# EAGLE schematic Wiring Diagram (EAGLE 7.7.0)
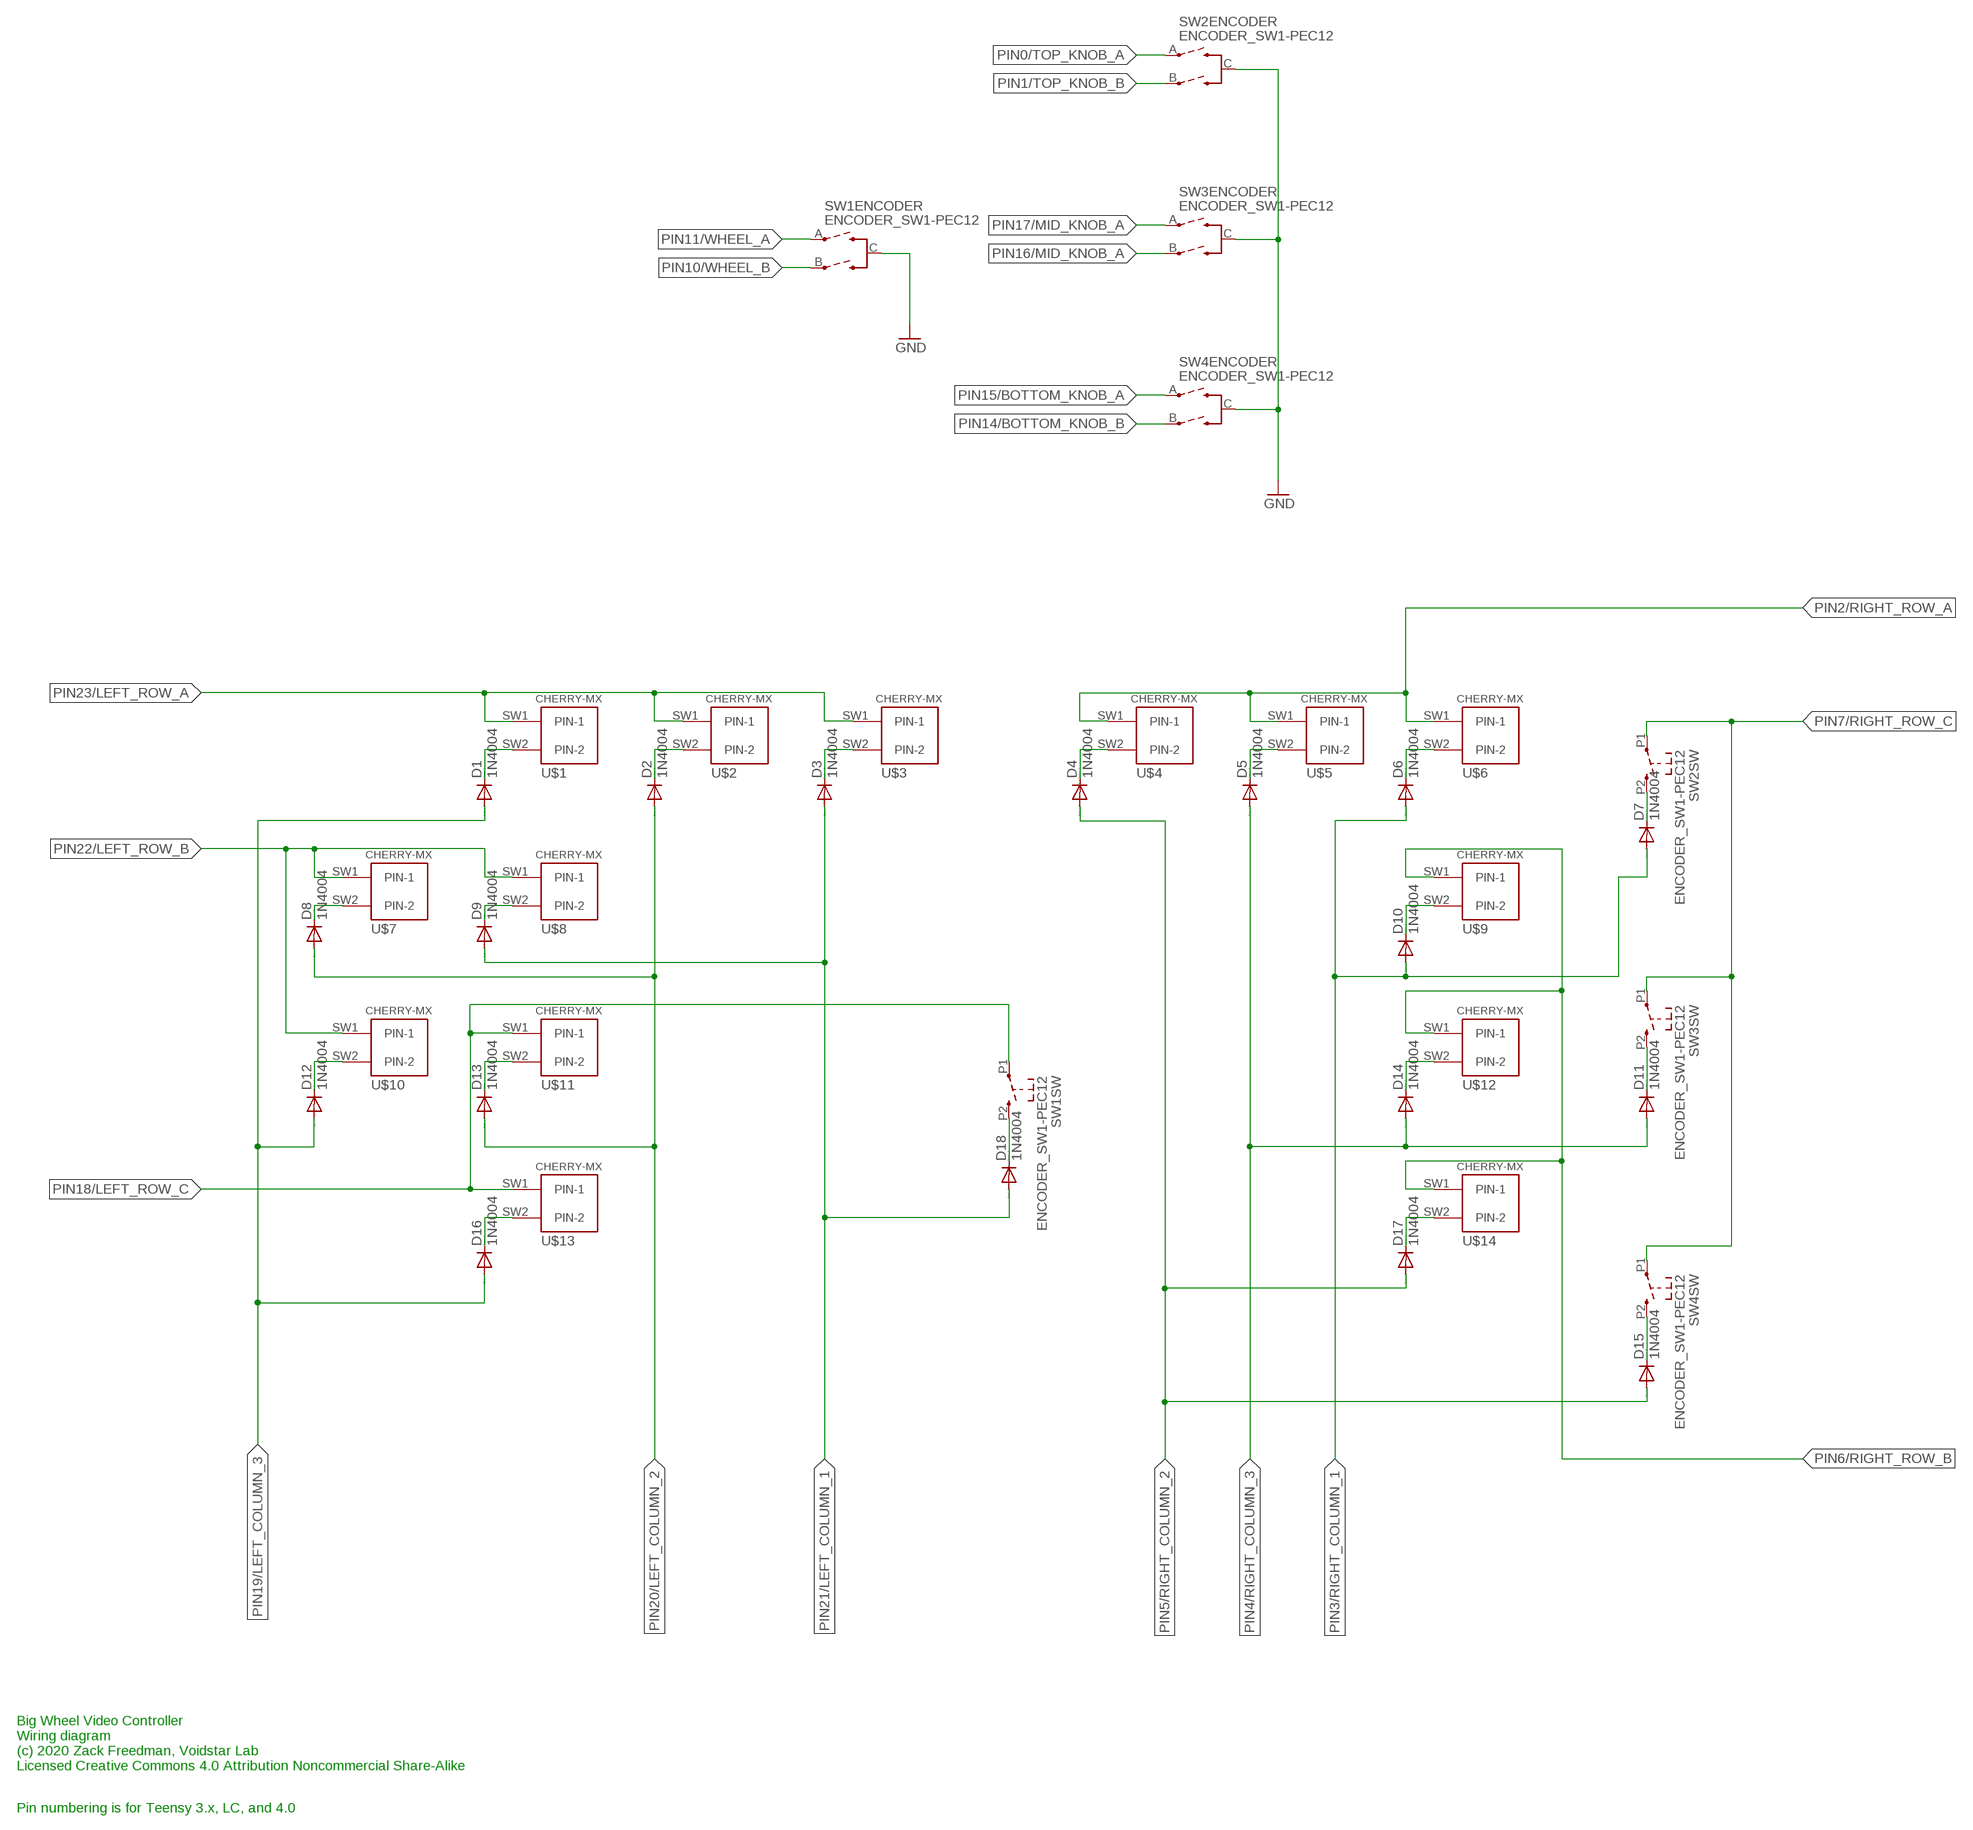
[diagram p0: schematic, sheet 1]

## Parts
D1  1N4004  [DO41-10]
D2  1N4004  [DO41-10]
D3  1N4004  [DO41-10]
D4  1N4004  [DO41-10]
D5  1N4004  [DO41-10]
D6  1N4004  [DO41-10]
D7  1N4004  [DO41-10]
D8  1N4004  [DO41-10]
D9  1N4004  [DO41-10]
D10  1N4004  [DO41-10]
D11  1N4004  [DO41-10]
D12  1N4004  [DO41-10]
D13  1N4004  [DO41-10]
D14  1N4004  [DO41-10]
D15  1N4004  [DO41-10]
D16  1N4004  [DO41-10]
D17  1N4004  [DO41-10]
D18  1N4004  [DO41-10]
SW1  ENCODER_SW1-PEC12  [PEC12_INCREMENTAL_ENCODER]
SW2  ENCODER_SW1-PEC12  [PEC12_INCREMENTAL_ENCODER]
SW3  ENCODER_SW1-PEC12  [PEC12_INCREMENTAL_ENCODER]
SW4  ENCODER_SW1-PEC12  [PEC12_INCREMENTAL_ENCODER]
U$1  CHERRY-MX  [CHERRY-MX]
U$2  CHERRY-MX  [CHERRY-MX]
U$3  CHERRY-MX  [CHERRY-MX]
U$4  CHERRY-MX  [CHERRY-MX]
U$5  CHERRY-MX  [CHERRY-MX]
U$6  CHERRY-MX  [CHERRY-MX]
U$7  CHERRY-MX  [CHERRY-MX]
U$8  CHERRY-MX  [CHERRY-MX]
U$9  CHERRY-MX  [CHERRY-MX]
U$10  CHERRY-MX  [CHERRY-MX]
U$11  CHERRY-MX  [CHERRY-MX]
U$12  CHERRY-MX  [CHERRY-MX]
U$13  CHERRY-MX  [CHERRY-MX]
U$14  CHERRY-MX  [CHERRY-MX]

## Nets
GND: SW1.C(ENCODER:C) SW2.C(ENCODER:C) SW3.C(ENCODER:C) SW4.C(ENCODER:C)
N$1: D1.C U$1.SW2(PIN-2)
N$2: D2.C U$2.SW2(PIN-2)
N$3: D3.C U$3.SW2(PIN-2)
N$6: D10.C U$9.SW2(PIN-2)
N$10: D9.C U$8.SW2(PIN-2)
N$12: D18.C SW1.P2
N$15: D12.C U$10.SW2(PIN-2)
N$16: D16.C U$13.SW2(PIN-2)
N$17: D8.C U$7.SW2(PIN-2)
N$18: D13.C U$11.SW2(PIN-2)
N$20: D6.C U$6.SW2(PIN-2)
N$21: D7.C SW2.P2
N$26: D11.C SW3.P2
N$27: D15.C SW4.P2
N$28: D17.C U$14.SW2(PIN-2)
N$29: D14.C U$12.SW2(PIN-2)
N$30: D5.C U$5.SW2(PIN-2)
N$31: D4.C U$4.SW2(PIN-2)
PIN0/TOP_KNOB_A: SW2.A(ENCODER:A)
PIN1/TOP_KNOB_B: SW2.B(ENCODER:B)
PIN2/RIGHT_ROW_A: U$4.SW1(PIN-1) U$5.SW1(PIN-1) U$6.SW1(PIN-1)
PIN3/RIGHT_COLUMN_1: D6.A D7.A D10.A
PIN4/RIGHT_COLUMN_3: D5.A D11.A D14.A
PIN5/RIGHT_COLUMN_2: D4.A D15.A D17.A
PIN6/RIGHT_ROW_B: U$9.SW1(PIN-1) U$12.SW1(PIN-1) U$14.SW1(PIN-1)
PIN7/RIGHT_ROW_C: SW2.P1 SW3.P1 SW4.P1
PIN10/WHEEL_B: SW1.B(ENCODER:B)
PIN11/WHEEL_A: SW1.A(ENCODER:A)
PIN14/BOTTOM_KNOB_B: SW4.B(ENCODER:B)
PIN15/BOTTOM_KNOB_A: SW4.A(ENCODER:A)
PIN16/MID_KNOB_A: SW3.B(ENCODER:B)
PIN17/MID_KNOB_A: SW3.A(ENCODER:A)
PIN18/LEFT_ROW_C: SW1.P1 U$11.SW1(PIN-1) U$13.SW1(PIN-1)
PIN19/LEFT_COLUMN_3: D1.A D12.A D16.A
PIN20/LEFT_COLUMN_2: D2.A D8.A D13.A
PIN21/LEFT_COLUMN_1: D3.A D9.A D18.A
PIN22/LEFT_ROW_B: U$7.SW1(PIN-1) U$8.SW1(PIN-1) U$10.SW1(PIN-1)
PIN23/LEFT_ROW_A: U$1.SW1(PIN-1) U$2.SW1(PIN-1) U$3.SW1(PIN-1)

## Notes on the sheet
- Big Wheel Video Controller
  Wiring diagram
  (c) 2020 Zack Freedman, Voidstar Lab
  Licensed Creative Commons 4.0 Attribution Noncommercial Share-Alike
- Pin numbering is for Teensy 3.x, LC, and 4.0

## Library data of the parts
D1-D18 = diode:1N4004: DIODE general purpose rectifier, 1 A
SW1-SW4 = dp_devices:ENCODER_SW1: Incremental Encoder with push switch
U$1-U$14 = cherrymx:CHERRY-MX: Cherry MX series keyswitch